# Altium schematic sheet XmasTree.SchDoc
size A4; DocumentNumber: 1; SheetNumber: 1; SheetTotal: 1
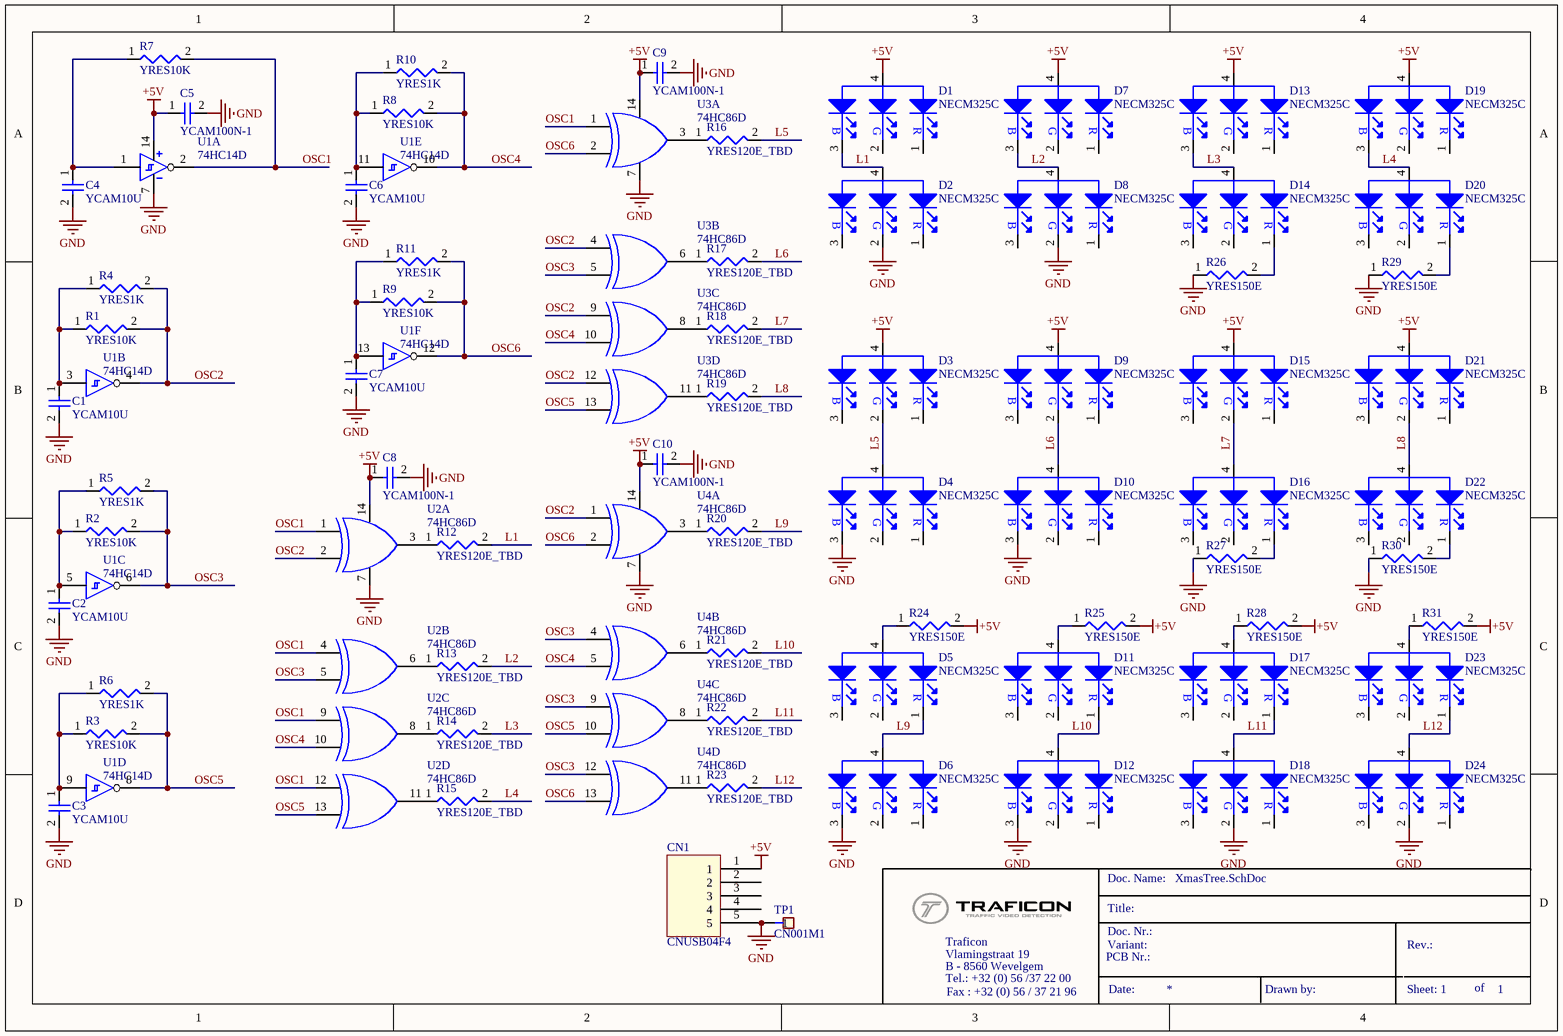
[diagram p0: XmasTree.SchDoc]

## Parts
C1  YCAM10U  [CA_1206]
C2  YCAM10U  [CA_1206]
C3  YCAM10U  [CA_1206]
C4  YCAM10U  [CA_1206]
C5  YCAM100N-1  [CA_0805]
C6  YCAM10U  [CA_1206]
C7  YCAM10U  [CA_1206]
C8  YCAM100N-1  [CA_0805]
C9  YCAM100N-1  [CA_0805]
C10  YCAM100N-1  [CA_0805]
CN1  CNUSB04F4  [CN_USB_AB_mini]
D1  NECM325C  [DI_PLCC4]
D2  NECM325C  [DI_PLCC4]
D3  NECM325C  [DI_PLCC4]
D4  NECM325C  [DI_PLCC4]
D5  NECM325C  [DI_PLCC4]
D6  NECM325C  [DI_PLCC4]
D7  NECM325C  [DI_PLCC4]
D8  NECM325C  [DI_PLCC4]
D9  NECM325C  [DI_PLCC4]
D10  NECM325C  [DI_PLCC4]
D11  NECM325C  [DI_PLCC4]
D12  NECM325C  [DI_PLCC4]
D13  NECM325C  [DI_PLCC4]
D14  NECM325C  [DI_PLCC4]
D15  NECM325C  [DI_PLCC4]
D16  NECM325C  [DI_PLCC4]
D17  NECM325C  [DI_PLCC4]
D18  NECM325C  [DI_PLCC4]
D19  NECM325C  [DI_PLCC4]
D20  NECM325C  [DI_PLCC4]
D21  NECM325C  [DI_PLCC4]
D22  NECM325C  [DI_PLCC4]
D23  NECM325C  [DI_PLCC4]
D24  NECM325C  [DI_PLCC4]
R1  YRES10K  [RE_1206]
R2  YRES10K  [RE_1206]
R3  YRES10K  [RE_1206]
R4  YRES1K  [RE_1206]
R5  YRES1K  [RE_1206]
R6  YRES1K  [RE_1206]
R7  YRES10K  [RE_1206]
R8  YRES10K  [RE_1206]
R9  YRES10K  [RE_1206]
R10  YRES1K  [RE_1206]
R11  YRES1K  [RE_1206]
R12  YRES120E_TBD  [RE_1206]
R13  YRES120E_TBD  [RE_1206]
R14  YRES120E_TBD  [RE_1206]
R15  YRES120E_TBD  [RE_1206]
R16  YRES120E_TBD  [RE_1206]
R17  YRES120E_TBD  [RE_1206]
R18  YRES120E_TBD  [RE_1206]
R19  YRES120E_TBD  [RE_1206]
R20  YRES120E_TBD  [RE_1206]
R21  YRES120E_TBD  [RE_1206]
R22  YRES120E_TBD  [RE_1206]
R23  YRES120E_TBD  [RE_1206]
R24  YRES150E  [RE_1206]
R25  YRES150E  [RE_1206]
R26  YRES150E  [RE_1206]
R27  YRES150E  [RE_1206]
R28  YRES150E  [RE_1206]
R29  YRES150E  [RE_1206]
R30  YRES150E  [RE_1206]
R31  YRES150E  [RE_1206]
TP1  CN001M1  [CN_TP_TH_1.3mm]
U1  74HC14D  [SC_SOIC14]  (parts A,B,C,D,E,F of 6)
U2  74HC86D  [SC_SOIC14]  (parts A,B,C,D of 4)
U3  74HC86D  [SC_SOIC14]  (parts A,B,C,D of 4)
U4  74HC86D  [SC_SOIC14]  (parts A,B,C,D of 4)

## Nets
+5V: C5.1 C8.1 C9.1 C10.1 CN1.1 D1.4(A) D3.4(A) D7.4(A) D9.4(A) D13.4(A) D15.4(A) D19.4(A) D21.4(A) R24.2 R25.2 R28.2 R31.2 U1.14 U2.14 U3.14 U4.14
GND: C1.2 C2.2 C3.2 C4.2 C5.2 C6.2 C7.2 C8.2 C9.2 C10.2 CN1.5 D2.2(C) D4.3(C) D6.3(C) D8.2(C) D10.3(C) D12.3(C) D18.2(C) D24.2(C) R26.1 R27.1 R29.1 R30.1 TP1.1 U1.7 U2.7 U3.7 U4.7
L1: D1.3(C) D2.4(A) R12.2
L2: D7.3(C) D8.4(A) R13.2
L3: D13.3(C) D14.4(A) R14.2
L4: D19.3(C) D20.4(A) R15.2
L5: D3.2(C) D4.4(A) R16.2
L6: D9.2(C) D10.4(A) R17.2
L7: D15.2(C) D16.4(A) R18.2
L8: D21.2(C) D22.4(A) R19.2
L9: D5.1(C) D6.4(A) R20.2
L10: D11.1(C) D12.4(A) R21.2
L11: D17.1(C) D18.4(A) R22.2
L12: D23.1(C) D24.4(A) R23.2
OSC1: R7.2 U1.2 U2.1 U2.4 U2.9 U2.12 U3.1
OSC2: R1.2 R4.2 U1.4 U2.2 U3.4 U3.9 U3.12 U4.1
OSC3: R2.2 R5.2 U1.6 U2.5 U3.5 U4.4 U4.9 U4.12
OSC4: R8.2 R10.2 U1.10 U2.10 U3.10 U4.5
OSC5: R3.2 R6.2 U1.8 U2.13 U3.13 U4.10
OSC6: R9.2 R11.2 U1.12 U3.2 U4.2 U4.13
NetC1_1: C1.1 R1.1 R4.1 U1.3
NetC2_1: C2.1 R2.1 R5.1 U1.5
NetC3_1: C3.1 R3.1 R6.1 U1.9
NetC4_1: C4.1 R7.1 U1.1
NetC6_1: C6.1 R8.1 R10.1 U1.11
NetC7_1: C7.1 R9.1 R11.1 U1.13
NetD5_4: D5.4(A) R24.1
NetD11_4: D11.4(A) R25.1
NetD14_1: D14.1(C) R26.2
NetD16_1: D16.1(C) R27.2
NetD17_4: D17.4(A) R28.1
NetD20_1: D20.1(C) R29.2
NetD22_1: D22.1(C) R30.2
NetD23_4: D23.4(A) R31.1
NetR12_1: R12.1 U2.3
NetR13_1: R13.1 U2.6
NetR14_1: R14.1 U2.8
NetR15_1: R15.1 U2.11
NetR16_1: R16.1 U3.3
NetR17_1: R17.1 U3.6
NetR18_1: R18.1 U3.8
NetR19_1: R19.1 U3.11
NetR20_1: R20.1 U4.3
NetR21_1: R21.1 U4.6
NetR22_1: R22.1 U4.8
NetR23_1: R23.1 U4.11

Not connected (* = marked no-connect by the designer): CN1 2 3 4; D1 1(C) 2(C); D2 1(C) 3(C); D3 1(C) 3(C); D4 1(C) 2(C); D5 2(C) 3(C); D6 1(C) 2(C); D7 1(C) 2(C); D8 1(C) 3(C); D9 1(C) 3(C); D10 1(C) 2(C); D11 2(C) 3(C); D12 1(C) 2(C); D13 1(C) 2(C); D14 2(C) 3(C); D15 1(C) 3(C); D16 2(C) 3(C); D17 2(C) 3(C); D18 1(C) 3(C); D19 1(C) 2(C); D20 2(C) 3(C); D21 1(C) 3(C); D22 2(C) 3(C); D23 2(C) 3(C); D24 1(C) 3(C)

## Notes on the sheet
- Title:
- Doc. Name:
- Traficon
- Vlamingstraat 19
- B - 8560 Wevelgem
- Tel.: +32 (0) 56 /37 22 00
- PCB Nr.:
- Doc. Nr.:
- Variant:
- Rev.:
- of
- Fax : +32 (0) 56 / 37 21 96
- Date:
- Drawn by:
- Sheet:
- (in symbol NECM325C) B; G; R

## Library data of the parts
CN1 = CNUSB04F4: Manufacturer: Multicomp; Order Code: Farnell 1696539; Part Number: CNUSB04F4; Component Type: connector
D1-D24 = NECM325C: Manufacturer: Nichia; Part Number: NECM325C; Component Type: led
R1-R3 R7-R9 = YRES10K: Resistor; Part Number: YRES10K; Component Type: resistor
R4-R6 R10 R11 = YRES1K: Resistor; Manufacturer: Vishay Draloric; Order Code: Farnell 1469965; Part Number: YRES1K; Component Type: resistor
R12-R23 = YRES120E_TBD: Resistor; Order Code: RS: 466-9568; Part Number: YRES120E_TBD; Component Type: resistor
R24-R31 = YRES150E: Resistor; Order Code: Farnell 1400434; Part Number: YRES150E; Component Type: resistor
U1 = 74HC14D: Manufacturer: On Semiconductor; Order Code: Farnell 9666931; Part Number: 74HC14D; Component Type: logic
U2-U4 = 74HC86D: Manufacturer: NXP; Order Code: Farnell 1085331; Part Number: 74HC86D; Component Type: logic
C1-C4 C6 C7 = YCAM10U: Part Number: YCAM10U; Component Type: capacitor
C5 C8-C10 = YCAM100N-1: Part Number: YCAM100N-1; Component Type: capacitor
TP1 = CN001M1: Part Number: CN001M1; Component Type: testpin